# EasyEDA Pro project ProPrj_WriteBotDriver_2025-05-26.epro, board PCB
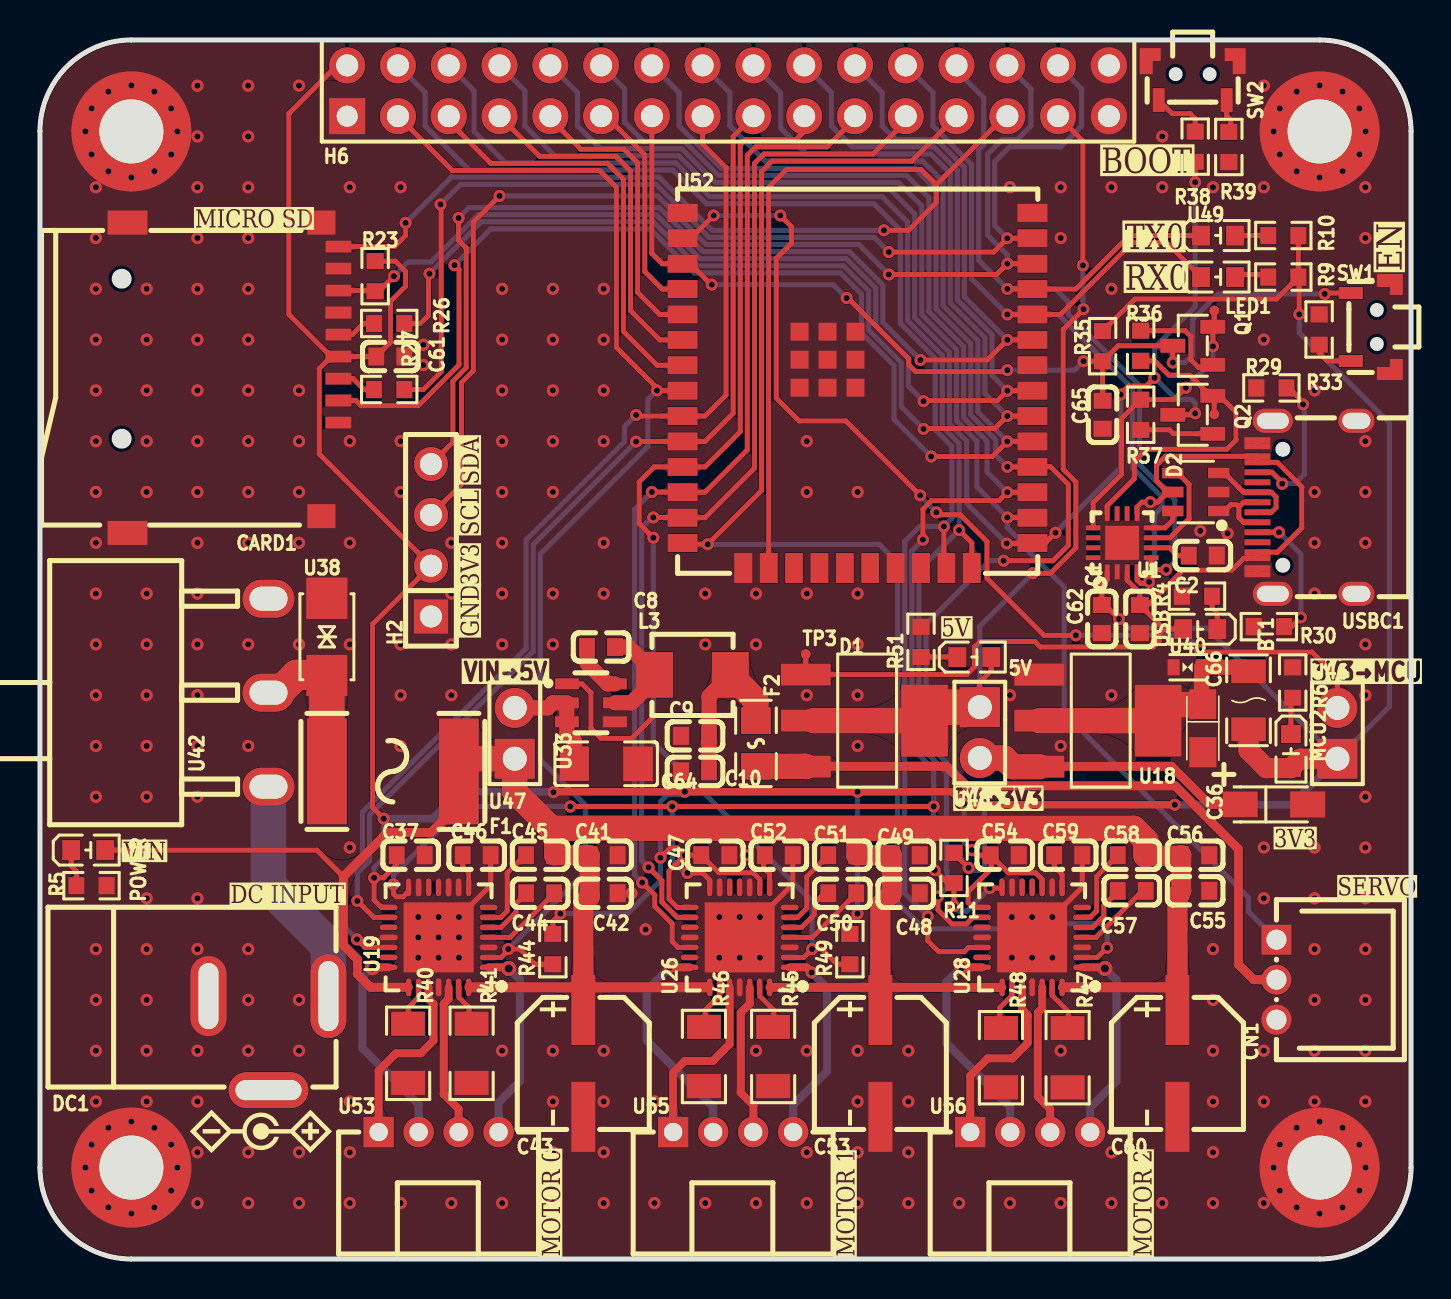
[diagram p5: board, top side]
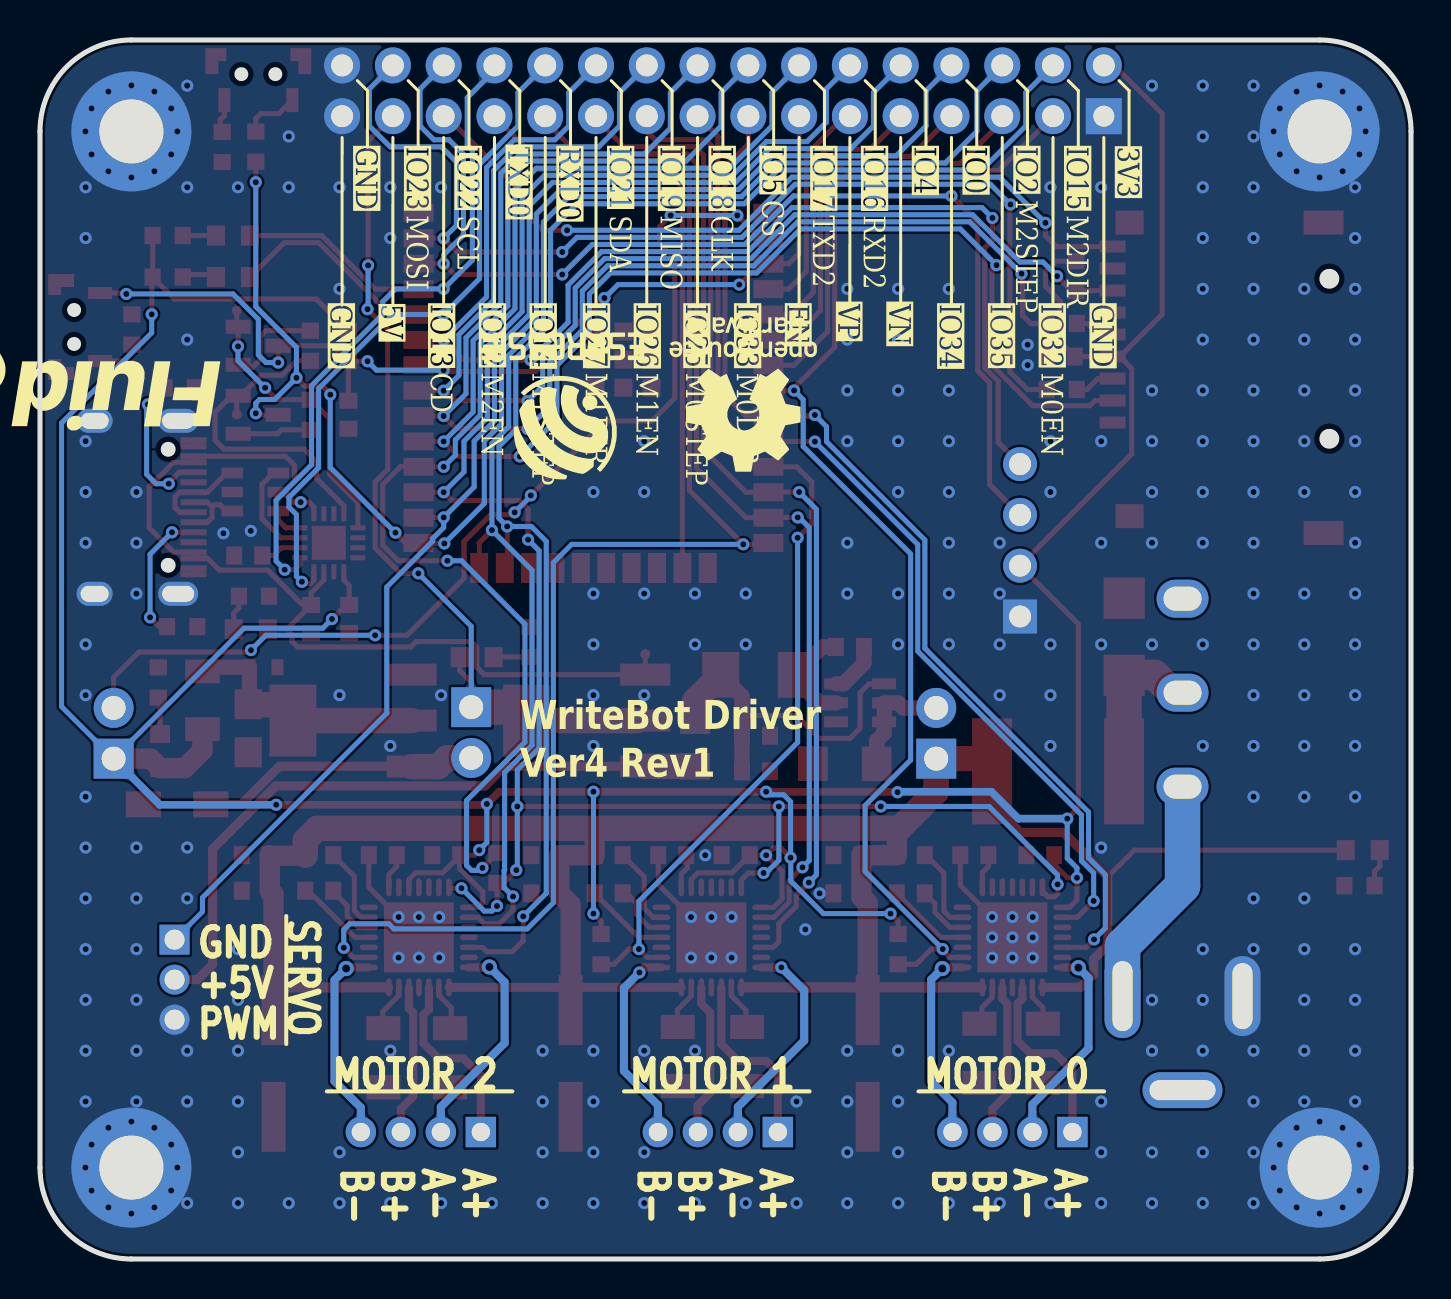
[diagram p6: board, bottom side, seen from below]

Outline 68.58 x 60.96 mm; copper layers: Top Layer, Bottom Layer. Coordinates in mm from the lower left corner of the outline.
Outline path: 0,56.39 0,4.57 arc(1.34,1.34) 4.57,0 64.01,0 arc(67.24,1.34) 68.58,4.57 68.58,56.39 arc(67.24,59.62) 64.01,60.96 4.57,60.96 arc(1.34,59.62) 0,56.39
Stack: Top Layer 0.035mm / Dielectric1 1.51mm FR4 er 4.5 / Bottom Layer 0.035mm

## Design rules (mm)
template: 自定义配置
spacing copperThickness1oz (default): track to track 0.102, other pairs 0.152 to 0.3
spacing copperThickness2oz: track to track 0.203, other pairs 0.152 to 0.3
track width copperThickness1oz (default): min 0.127, default 0.254, max 2.54
track width copperThickness2oz: min 0.254, default 0.457, max 2.54
track width MotorOutput: min 0.254, default 0.406, max 2.54
differential pair differentialPair (default): width min 0.127, default 0.254, max 2.54; gap min 0.152, default 0.152
via viaSize (default): diameter min 0.5, default 0.61, max 10; hole min 0.3, default 0.305, max 6.299
net VIN uses copperThickness2oz
net 5VBUCK uses copperThickness2oz
net M1OA+ uses MotorOutput
net M0OB+ uses MotorOutput
net M0OA+ uses MotorOutput
net M0OA- uses MotorOutput
net M0OB- uses MotorOutput
net M1OB+ uses MotorOutput
net M1OA- uses MotorOutput
net M1OB- uses MotorOutput
net M2OB+ uses MotorOutput
net M2OA+ uses MotorOutput
net M2OA- uses MotorOutput
net M2OB- uses MotorOutput
net 5V uses copperThickness2oz

## Placement (name value [footprint] x y rotation side)
5V  YLED0603R  [LED0603-FD]  46.74 30.1 180 top
BT1  nSMD100-24V  [F1206]  60.45 27.94 270 top
C1  1uF  [C0603]  55.02 32.01 270 top
C2  100nF  [C0603]  58.17 35.18 180 top
C8  100nF  [C0603]  28.07 30.61 0 top
C9  22uF  [C0603]  32.77 26.16 0 top
C10  22uF  [C0603]  32.77 24.38 0 top
C36  10uF  [CAP-SMD_L3.2-W1.6-RD-C7171]  61.72 22.73 0 top
C37  100nF  [C0603]  18.54 20.19 180 top
C41  100nF  [C0603]  28.19 20.19 180 top
C42  100nF  [C0603]  28.19 18.29 180 top
C43  100uF  [CAP-SMD_BD6.3-L6.5-W6.5-LS7.2-FD]  27.18 9.78 270 top
C44  22nF  [C0603]  25.02 18.29 0 top
C45  100nF  [C0603]  25.02 20.19 180 top
C46  2.2uF  [C0603]  21.84 20.19 180 top
C47  100nF  [C0603]  33.78 20.19 180 top
C48  100nF  [C0603]  43.31 18.29 180 top
C49  100nF  [C0603]  43.31 20.19 180 top
C50  22nF  [C0603]  40.13 18.29 0 top
C51  100nF  [C0603]  40.13 20.19 180 top
C52  2.2uF  [C0603]  36.96 20.19 180 top
C53  100uF  [CAP-SMD_BD6.3-L6.5-W6.5-LS7.2-FD]  42.04 9.78 270 top
C54  100nF  [C0603]  48.26 20.19 180 top
C55  100nF  [C0603]  57.78 18.42 180 top
C56  100nF  [C0603]  57.78 20.19 180 top
C57  22nF  [C0603]  54.61 18.42 0 top
C58  100nF  [C0603]  54.61 20.19 180 top
C59  2.2uF  [C0603]  51.44 20.19 180 top
C60  100uF  [CAP-SMD_BD6.3-L6.5-W6.5-LS7.2-FD]  56.9 9.78 270 top
C61  100nF  [C0603]  17.52 45.13 180 top
C62  100nF  [C0603]  53.11 32.01 270 top
C64  10uF  [C1206]  28.32 24.77 180 top
C65  680nF  [C0603]  53.15 42.22 270 top
C66  22uF  [CASE-A_3216]  58.17 26.54 270 top
CARD1  TF-01A  [TF-SMD_TF-01A]  9.65 44.07 270 top
CN1  PH-3AW  [CONN-TH_3P-P2.00_HCTL_PH-3AW_C2908635]  61.85 13.97 90 top
D1  20CJQ100  [SOT-223-3_L6.5-W3.4-P2.30-LS7.0-BR]  41.28 26.92 180 top
D2  USBLC6-2SC6  [SOT-23-6_L2.9-W1.6-P0.95-LS2.8-BL]  57.81 38.36 90 top
DC1  DC-005-5A-2.5  [DC-IN-TH_DC-005-5A-2.5]  11.43 10.8 0 top
F1  2920L400/30GR  [F2920]  17.65 24.38 180 top
F2  SL0805200  [F0805]  35.81 25.78 270 top
H2  PM2.54-1*4  [HDR-TH_4P-P2.54-V-F]  19.56 35.94 90 top
H6  B-2100S32P-B110  [HDR-TH_32P-P2.54-V-M-R2-C16-S2.54]  34.42 58.42 0 top
L3  4.7uH  [IND-SMD_L4.5-W4.1_IHLP]  32.64 29.21 0 top
LED1  YLED0603B  [LED0603-FD]  58.93 49.11 180 top
MCU2  YLED0603R  [LED0603-FD]  62.57 25.4 90 top
NOREF  -  [Pad_e30]  4.57 56.39 0 top
NOREF#2  -  [Pad_e123]  64.01 56.39 0 top
NOREF#3  -  [Pad_e125]  4.57 4.57 0 top
NOREF#4  -  [Pad_e124]  64.01 4.57 0 top
POWER  YLED0603R  [LED0603-FD]  2.41 20.45 180 top
Q1  MMS8050-H-TP  [SOT-23-3_L2.9-W1.3-P1.90-LS2.4-BR]  57.66 45.67 0 top
Q2  MMS8050-H-TP  [SOT-23-3_L2.9-W1.3-P1.90-LS2.4-BR]  57.66 42.22 0 top
R4  1kΩ  [R0603]  57.88 33.15 180 top
R5  5.1kΩ  [R0603]  2.58 18.67 0 top
R6  680Ω  [R0603]  62.66 28.83 90 top
R9  680Ω  [R0603]  62.19 49.11 0 top
R10  680Ω  [R0603]  62.19 51.18 0 top
R11  1kΩ  [R0603]  45.72 19.56 90 top
R23  10kΩ  [R0603]  16.76 49.15 90 top
R26  10Ω  [R0603]  17.47 46.78 0 top
R27  10Ω  [R0603]  17.47 43.48 0 top
R29  5.1kΩ  [R0603]  61.59 43.56 180 top
R30  5.1kΩ  [R0603]  61.47 31.62 180 top
R33  100Ω  [R0603]  63.98 46.48 270 top
R35  10kΩ  [R0603]  53.15 45.65 90 top
R36  10kΩ  [R0603]  55.06 45.67 270 top
R37  10kΩ  [R0603]  55.06 42.22 90 top
R38  10kΩ  [R0603]  57.78 55.63 270 top
R39  100Ω  [R0603]  59.47 55.61 90 top
R40  120mΩ  [R1206]  18.41 10.29 270 top
R41  120mΩ  [R1206]  21.59 10.29 270 top
R44  10kΩ  [R0603]  25.65 15.49 90 top
R45  120mΩ  [R1206]  36.67 10.13 270 top
R46  120mΩ  [R1206]  33.21 10.13 270 top
R47  120mΩ  [R1206]  51.4 10.07 270 top
R48  120mΩ  [R1206]  48.07 10.07 270 top
R49  10kΩ  [R0603]  40.51 15.49 90 top
R51  1kΩ  [R0603]  44.07 30.86 90 top
SW1  TS24CA  [SW-SMD_TS24CA]  66.55 46.61 270 top
SW2  TS24CA  [SW-SMD_TS24CA]  57.66 58.93 0 top
TP1  -  [Test-Point-0.5mm]  58.74 42.24 0 top
TP2  -  [Test-Point-0.5mm]  58.74 47.43 0 top
TP3  -  [Test-Point-0.5mm]  38.31 30.25 0 top
U1  CH343P  [TQFN-16_L3.0-W3.0-P0.50-BL-EP1.7]  54.13 35.82 0 top
U18  AMS1117-3.3  [SOT-223-3_L6.5-W3.4-P2.30-LS7.0-BR]  52.96 26.92 180 top
U19  TMC2209-LA-T  [QFN-28_L5.0-W5.0-P0.50-BL-EP]  19.94 16.08 90 top
U26  TMC2209-LA-T  [QFN-28_L5.0-W5.0-P0.50-BL-EP]  35 16.08 90 top
U28  TMC2209-LA-T  [QFN-28_L5.0-W5.0-P0.50-BL-EP]  49.63 16.08 90 top
U33  AP63205WU-7  [TSOT-23-6_L2.9-W1.6-P0.95-LS2.8-BL]  27.56 27.81 270 top
U38  SMAJ28CA  [DO-214AC_L4.3-W2.7-LS5.0-BI]  14.35 31.12 270 top
U40  H3V3LD5B  [SOD-523F_L1.7-W0.9-LS1.7-BI]  57.4 29.59 0 top
U42  SS-12M12G5  [SW-TH_SS-12M12G5]  11.43 28.32 90 top
U46  2.54-1*2  [HDR-TH_2P-P2.54-V-M]  64.9 26.29 90 top
U47  2.54-1*2  [HDR-TH_2P-P2.54-V-M]  23.75 26.29 90 top
U48  2.54-1*2  [HDR-TH_2P-P2.54-V-M]  47.01 26.33 270 top
U49  YLED0603G  [LED0603-FD]  58.93 51.18 180 top
U52  ESP32-WROOM-32UE-N16  [COMM-SMD_ESP32-WROOM-32UE-N16]  40.89 43.43 0 top
U53  WAFER-PH2.0-4PWZ  [CONN-TH_4P-P2.00_BX-PH2.0-4PWZ]  19.94 6.35 0 top
U55  WAFER-PH2.0-4PWZ  [CONN-TH_4P-P2.00_BX-PH2.0-4PWZ]  34.67 6.35 0 top
U56  WAFER-PH2.0-4PWZ  [CONN-TH_4P-P2.00_BX-PH2.0-4PWZ]  49.53 6.35 0 top
USB  YLED0603R  [LED0603-FD]  58.04 31.5 0 top
USBC1  TYPE-C-31-M-12  [USB-C_SMD-TYPE-C-31-M-12]  63.37 37.59 90 top

## Footprints (pads in the part's own frame, mm; a bottom-side part is the same pattern mirrored in y, then rotated)
C0603
  rect 0.8x0.9 smd: 1(-0.7,0) 2(0.7,0)
C1206
  rect 1.485x1.728 smd: 1(-1.593,0) 2(1.593,0)
CAP-SMD_BD6.3-L6.5-W6.5-LS7.2-FD
  rect 3.5x1.2 smd: 1(-2.67,0) 2(2.67,0)
CAP-SMD_L3.2-W1.6-RD-C7171
  rect 1.758x1.296 smd: 1(-1.687,0) 2(1.687,0)
CASE-A_3216
  rect 1.5x1.359 smd: 1(-1.2,0) 2(1.2,0)
COMM-SMD_ESP32-WROOM-32UE-N16
  rect 1.5x0.9 smd: 1(-8.75,8.88) 2(-8.75,7.61) 3(-8.75,6.34) 4(-8.75,5.07) 5(-8.75,3.8) 6(-8.75,2.53) 7(-8.75,1.26) 8(-8.75,-0.01) 9(-8.75,-1.28) 10(-8.75,-2.55) 11(-8.75,-3.82) 12(-8.75,-5.09) 13(-8.75,-6.36) 14(-8.75,-7.63) 25(8.75,-7.63) 26(8.75,-6.36) 27(8.75,-5.09) 28(8.75,-3.82) 29(8.75,-2.55) 30(8.75,-1.28) 31(8.75,-0.01) 32(8.75,1.26) 33(8.75,2.53) 34(8.75,3.8) 35(8.75,5.07) 36(8.75,6.34) 37(8.75,7.61) 38(8.75,8.88)
  rect 0.9x1.5 smd: 15(-5.715,-8.88) 16(-4.445,-8.88) 17(-3.175,-8.88) 18(-1.905,-8.88) 19(-0.635,-8.88) 20(0.635,-8.88) 21(1.905,-8.88) 22(3.175,-8.88) 23(4.445,-8.88) 24(5.715,-8.88)
  rect 0.9x0.9 smd: 39(-2.9,2.939) 39(-2.9,1.54) 39(-2.9,0.14) 39(-1.5,2.939) 39(-1.5,1.54) 39(-1.5,0.14) 39(-0.1,2.939) 39(-0.1,1.54) 39(-0.1,0.14)
CONN-TH_3P-P2.00_HCTL_PH-3AW_C2908635
  rect 1.5x1.5 hole 1: 1(2.001,0)
  round 1.5 hole 1: 2(0,0) 3(-2.001,0)
CONN-TH_4P-P2.00_BX-PH2.0-4PWZ
  rect 1.524x1.524 hole 0.914: 1(-3,0)
  round 1.524 hole 0.914: 2(-1,0) 3(1,0) 4(3,0)
DC-IN-TH_DC-005-5A-2.5
  oval 1.8x4.2 hole 1x3.5: 1(3,2.352)
  oval 1.8x4 hole 1x3.3: 2(-3,2.352)
  oval 4x1.8 hole 3.3x1: 3(-0.001,-2.352)
DO-214AC_L4.3-W2.7-LS5.0-BI
  rect 2.07x2.06 smd: 1(-1.929,0) 2(1.929,0)
F0805
  rect 1.335x1.5 smd: 1(-1.143,0) 2(1.143,0)
F1206
  rect 1.19x1.728 smd: 1(-1.445,0) 2(1.445,0)
F2920
  rect 2x5.3 smd: 1(-3.3,0) 2(3.3,0)
HDR-TH_2P-P2.54-V-M
  rect 2x2 hole 1.2: 1(-1.27,0)
  round 2 hole 1.2: 2(1.27,0)
HDR-TH_4P-P2.54-V-F
  rect 1.7x1.7 hole 1.1: 1(-3.81,0)
  round 1.7 hole 1.1: 2(-1.27,0) 3(1.27,0) 4(3.81,0)
HDR-TH_32P-P2.54-V-M-R2-C16-S2.54
  rect 1.8x1.8 hole 1.05: 1(-19.05,-1.27)
  round 1.8 hole 1.1x1.05: 2(-19.05,1.27) 3(-16.51,-1.27) 4(-16.51,1.27) 5(-13.97,-1.27) 6(-13.97,1.27) 7(-11.43,-1.27) 8(-11.43,1.27) 9(-8.89,-1.27) 10(-8.89,1.27) 11(-6.35,-1.27) 12(-6.35,1.27) 13(-3.81,-1.27) 14(-3.81,1.27) 15(-1.27,-1.27) 16(-1.27,1.27) 17(1.27,-1.27) 18(1.27,1.27) 19(3.81,-1.27) 20(3.81,1.27) 21(6.35,-1.27) 22(6.35,1.27) 23(8.89,-1.27) 24(8.89,1.27) 25(11.43,-1.27) 26(11.43,1.27) 27(13.97,-1.27) 28(13.97,1.27) 29(16.51,-1.27) 30(16.51,1.27) 31(19.05,-1.27) 32(19.05,1.27)
IND-SMD_L4.5-W4.1_IHLP
  rect 1.855x2.286 smd: 1(-1.893,0) 2(1.893,0)
LED0603-FD
  rect 0.9x1 smd: 1(-0.85,0) 2(0.85,0)
Pad_e30
  round 6 hole 3.2: 1(0,0)
Pad_e123
  round 6 hole 3.2: 1(0,0)
Pad_e124
  round 6 hole 3.2: 1(0,0)
Pad_e125
  round 6 hole 3.2: 1(0,0)
QFN-28_L5.0-W5.0-P0.50-BL-EP
  oval 0.28x0.9 smd: 1(-1.502,-2.5) 2(-1.001,-2.5) 3(-0.5,-2.5) 4(0,-2.5) 5(0.5,-2.5) 6(1,-2.5) 7(1.501,-2.5) 15(1.501,2.5) 16(1,2.5) 17(0.5,2.5) 18(0,2.5) 19(-0.5,2.5) 20(-1.001,2.5) 21(-1.502,2.5)
  oval 0.9x0.28 smd: 8(2.5,-1.502) 9(2.5,-1.001) 10(2.5,-0.5) 11(2.5,0) 12(2.5,0.5) 13(2.5,1) 14(2.5,1.501) 22(-2.5,1.501) 23(-2.5,1) 24(-2.5,0.5) 25(-2.5,0) 26(-2.5,-0.5) 27(-2.5,-1.001) 28(-2.5,-1.502)
  rect 3.5x3.5 smd: 29(0,0)
R0603
  rect 0.806x0.864 smd: 1(-0.753,0) 2(0.753,0)
R1206
  rect 1.208x1.701 smd: 1(-1.479,0) 2(1.479,0)
SOD-523F_L1.7-W0.9-LS1.7-BI
  rect 0.6x0.8 smd: 1(-0.7,0) 2(0.7,0)
SOT-23-3_L2.9-W1.3-P1.90-LS2.4-BR
  rect 1.25x0.7 smd: 1(1,-0.95) 2(1,0.95) 3(-1,0)
SOT-23-6_L2.9-W1.6-P0.95-LS2.8-BL
  rect 0.532x1.072 smd: 1(-0.95,-1.149) 2(0,-1.149) 3(0.95,-1.149) 4(0.95,1.149) 5(0,1.149) 6(-0.95,1.149)
SOT-223-3_L6.5-W3.4-P2.30-LS7.0-BR
  rect 2.5x1.1 smd: 1(2.97,-2.3) 2(2.97,0) 3(2.97,2.3)
  rect 2.34x3.6 smd: 4(-2.97,0)
SW-SMD_TS24CA
  custom 1.05x1.3 smd: 1(-2.125,0.975) 2(2.125,0.975)
  rect 0.6x1.2 smd: 3(-1.7,-0.975) 4(1.7,-0.975)
SW-TH_SS-12M12G5
  oval 1.9x2.6 hole 1.2x1.9: 1(-4.7,0) 2(0,0) 3(4.7,0)
Test-Point-0.5mm
  round 0.5 smd: 1(0,0)
TF-SMD_TF-01A
  rect 0.6x1.3 smd: 1(2.24,5.276) 2(1.14,5.276) 3(0.04,5.276) 4(-1.06,5.276) 5(-2.16,5.276) 6(-3.26,5.276) 7(-4.36,5.276) 8(-5.46,5.276) 9(-6.56,5.276)
  rect 1.2x1.4 smd: 10(-7.76,4.426) 13(6.92,4.426)
  rect 1.2x2 smd: 11(-7.76,-5.276) 12(7.76,-5.276)
TQFN-16_L3.0-W3.0-P0.50-BL-EP1.7
  rect 0.25x0.75 smd: 1(-0.749,-1.45) 2(-0.248,-1.45) 3(0.252,-1.45) 4(0.751,-1.45) 9(0.75,1.45) 10(0.25,1.45) 11(-0.25,1.45) 12(-0.749,1.45)
  rect 0.75x0.25 smd: 5(1.45,-0.75) 6(1.45,-0.25) 7(1.45,0.25) 8(1.45,0.75) 13(-1.45,0.75) 14(-1.45,0.25) 15(-1.45,-0.25) 16(-1.45,-0.75)
  rect 1.7x1.7 smd: 17(0.001,0)
TSOT-23-6_L2.9-W1.6-P0.95-LS2.8-BL
  rect 0.55x1.2 smd: 1(-0.95,-1.2) 2(0,-1.2) 3(0.95,-1.2) 4(0.95,1.2) 5(0,1.2) 6(-0.95,1.2)
USB-C_SMD-TYPE-C-31-M-12
  oval 1.2x2 hole 0.8x1.6: 0(-4.325,1.706) 1(4.325,1.706)
  oval 1.2x1.8 hole 0.8x1.4: 2(4.325,-2.474) 3(-4.325,-2.474)
  rect 0.3x1.3 smd: A1(-3.35,2.474) A4(-2.55,2.474) A5(-1.25,2.474) A6(-0.25,2.474) A7(0.25,2.474) A8(1.25,2.474) A9(2.55,2.474) A12(3.35,2.474) B1(3.05,2.474) B4(2.25,2.474) B5(1.75,2.474) B6(0.75,2.474) B7(-0.75,2.474) B8(-1.75,2.474) B9(-2.25,2.474) B12(-3.05,2.474)

## Nets
As in the schematic, except:
GND: C1.2 C2.1 C9.1 C10.1 C36.2 C37.1 C41.1 C42.1 C43.2 C46.1 C47.1 C48.1 C49.1 C52.1 C53.2 C54.1 C55.1 C56.1 C59.1 C60.2 C61.1 C62.2 C64.1 C65.2 C66.2 CARD1.6 CARD1.10 CARD1.11 CARD1.12 CARD1.13 CN1.3 D2.2 DC1.2 H2.1 H6.1 H6.31 H6.32 NOREF.1 NOREF#2.1 NOREF#3.1 NOREF#4.1 R4.2 R5.2 R6.2 R29.2 R30.2 R33.1 R39.1 R40.2 R41.2 R45.2 R46.2 R47.2 R48.2 R51.2 SW1.1 SW1.2 SW2.1 SW2.2 U1.2 U1.17 U18.1 U19.3 U19.9 U19.10 U19.13 U19.18 U19.25 U19.29 U26.3 U26.10 U26.13 U26.18 U26.25 U26.29 U28.3 U28.9 U28.13 U28.18 U28.25 U28.29 U33.4 U38.1 U40.1 U52.1 U52.15 U52.38 U52.39 USBC1.0 USBC1.1 USBC1.2 USBC1.3 USBC1.A1 USBC1.A12 USBC1.B1 USBC1.B12

Pads without a net: CARD1 1 8; DC1 3; U1 10 11 14 15 16; U19 7 11 12 17 20; U26 7 11 12 17 20; U28 7 11 12 17 20; U42 3; U52 17 18 19 20 21 22 32; USBC1 A8 B8

## Via types
v1: diameter 0.61, hole 0.305, Top Layer to Bottom Layer, 392 vias
v2: diameter 0.762, hole 0.406, Top Layer to Bottom Layer, 4 vias

## Routing (per net, layer and track width the routed paths; a pad name or vN(x,y) marks a point on that pad's centre or on a via; arc(x,y) is an arc through that point)
3V3: length 212.6
  Top Layer w0.254: C54.2 46.86,20.19 v1(46.61,20.45) ; R23.2 17.78,49.9 18.29,49.39 18.29,48.64 17.53,47.88 17.53,45.83 C61.2 16.82,45.13 CARD1.4 ; CARD1.4 14.88,45.09 14.52,45.09 13.97,44.53 13.97,40.26 H2.2 16.64,31.75 16.64,22.58 v1(17.19,22.02) ; CARD1.4 14.56,45.13 12.45,47.24 12.45,57.28 14.86,59.69 H6.2 ; U1.1 53.38,33.95 53.11,33.68 C62.1 53.27,32.71 v1(53.97,32) ; v1(40.89,17.27) 40.51,16.89 R49.2 ; C37.2 17.84,19.72 17.18,19.06 v1(16.71,19.06) 16.71,17.95 17.08,17.59 U19.15 ; U28.10 50.13,18.99 49.8,19.31 48.44,19.31 47.6,20.16 47.59,20.16 47.59,19.52 46.43,18.36 46.43,17.83 46.68,17.59 U28.15 ; v1(32.26,20.19) 31.89,20.56 31.53,20.56 v1(31.04,20.07) ; v1(32.26,20.19) 31.46,19.4 31.46,18 31.88,17.59 U26.15 ; v1(32.26,20.19) C47.2 33.96,19.31 35.67,19.31 36,18.99 U26.9 ; v1(62.99,47.24) 62.98,47.25 62.98,48.82 62.87,48.94 ; R35.2 54.76,48.01 61.85,48.01 62.95,49.1 62.95,51.18 ; v1(26.03,17.27) 25.65,16.89 R44.2
  Top Layer w0.381: v1(25.69,23.34) 25.71,23.37 v1(32.26,23.37) v1(40.89,23.37) 45.62,23.37 v1(46.23,22.76) 46.27,22.71 v1(56.76,22.71)
  Top Layer w1.016: BT1.2 60.45,25.44 61.34,24.55 MCU2.1 63.04,25.02 U46.1
  Bottom Layer w0.254: v1(17.19,22.02) 17.19,20.04 16.71,19.56 v1(16.71,19.06) ; v1(46.23,22.76) 46.23,20.83 v1(46.61,20.45) ; 56.75,22.73 v1(56.76,22.71) ; v1(40.89,17.27) v1(40.89,23.37) ; v1(26.03,17.27) 29.39,17.27 31.02,18.9 31.02,20.06 v1(31.04,20.07) 31.04,22.87 31.38,23.22 32.11,23.22 v1(32.26,23.37) ; v1(53.97,32) 54.43,31.55 58.37,31.55 U46.1 67.5,27.62 67.5,41.81 62.99,46.32 v1(62.99,47.24)
  Bottom Layer w0.381: v1(17.19,22.02) 19.64,22.02 20.99,23.37 25.66,23.37 v1(25.69,23.34) ; v1(56.76,22.71) 62.59,22.71 U46.1
5V: length 44.6
  Top Layer w0.254: U48.1 46.99,27.62 46.99,28.83 47.59,29.43 5V.1 ; v1(52.2,47.5) 51.18,46.48 51.18,39.49 51.82,38.86 51.82,35.57 50.54,34.29 v1(49.66,34.29) ; v1(52.17,49.69) 52.17,55.91 H6.29
  Top Layer w1.27: 38.69,26.92 D1.4 44.92,27.6
  Top Layer w1.778: U48.1 44.92,27.6
  Bottom Layer w0.254: v1(49.66,34.29) 47.01,31.64 U48.1 ; v1(52.17,49.69) 52.17,47.53 v1(52.2,47.5)
5VBUCK: length 33.9
  Top Layer w0.457: 38.29,24.64 45.34,24.64 46.32,23.66 56.79,23.66 59.94,20.51 59.94,14.73 60.71,13.97 CN1.2
  Top Layer w1.27: F2.2 38.29,24.64 ; D1.3 38.29,24.64
GND: length 14.7
  Top Layer w0.254: v1(50.64,17.1) 52.13,18.59 C59.1 ; C52.1 37.66,18.74 v1(36.01,17.1) U26.29 ; C46.1 22.54,18.69 v1(20.96,17.1) v1(19.94,16.08) ; USBC1.A12 USBC1.B1 ; USBC1.B12 USBC1.A1
  vias: v1(2.27,56.39) v1(2.27,4.57) v1(2.58,57.54) v1(2.58,55.24) v1(2.58,5.72) v1(2.58,3.42) v1(2.8,53.6) v1(2.8,51.06) v1(2.8,48.52) v1(2.8,45.98) v1(2.8,43.44) v1(2.8,40.9) v1(2.8,38.36) v1(2.8,35.82) v1(2.8,33.28) v1(2.8,30.74) v1(2.8,28.2) v1(2.8,25.66) v1(2.8,23.12) v1(2.8,15.5) v1(2.8,12.96) v1(2.8,10.42) v1(2.8,7.88) v1(3.42,58.38) v1(3.42,54.4) v1(3.42,6.56) v1(3.42,2.58) v1(4.57,58.69) v1(4.57,54.09) v1(4.57,6.87) v1(4.57,2.27) v1(5.34,48.52) v1(5.34,45.98) v1(5.34,43.44) v1(5.34,40.9) v1(5.34,38.36) v1(5.34,33.28) v1(5.34,30.74) v1(5.34,28.2) v1(5.34,25.66) v1(5.34,23.12) v1(5.34,18.04) v1(5.34,15.5) v1(5.34,12.96) v1(5.34,10.42) v1(5.34,7.88) v1(5.72,58.38) v1(5.72,54.4) v1(5.72,6.56) v1(5.72,2.58) v1(6.56,57.54) v1(6.56,55.24) v1(6.56,5.72) v1(6.56,3.42) v1(6.87,56.39) v1(6.87,4.57) v1(7.88,58.68) v1(7.88,56.14) v1(7.88,53.6) v1(7.88,51.06) v1(7.88,48.52) v1(7.88,45.98) v1(7.88,43.44) v1(7.88,40.9) v1(7.88,38.36) v1(7.88,35.82) v1(7.88,33.28) v1(7.88,30.74) v1(7.88,28.2) v1(7.88,25.66) v1(7.88,23.12) v1(7.88,18.04) v1(7.88,15.5) v1(7.88,10.42) v1(7.88,7.88) v1(7.88,5.34) v1(7.88,2.8) v1(10.42,58.68) v1(10.42,56.14) v1(10.42,53.6) v1(10.42,51.06) v1(10.42,48.52) v1(10.42,45.98) v1(10.42,43.44) v1(10.42,40.9) v1(10.42,38.36) v1(10.42,35.82) v1(10.42,30.74) v1(10.42,25.66) v1(10.42,15.5) v1(10.42,12.96) v1(10.42,10.42) v1(10.42,5.34) v1(10.42,2.8) v1(12.96,58.68) v1(12.96,43.44) v1(12.96,40.9) v1(12.96,38.36) v1(12.96,35.82) v1(12.96,30.74) v1(12.96,12.96) v1(12.96,10.42) v1(12.96,5.34) v1(12.96,2.8) v1(15.5,53.6) v1(15.5,40.9) v1(15.5,35.82) v1(15.5,30.74) v1(15.5,20.58) v1(15.5,7.88) v1(15.5,5.34) v1(15.5,2.8) v1(18.04,53.6) v1(18.04,40.9) v1(18.04,38.36) v1(18.04,30.74) v1(18.04,28.2) v1(18.04,25.66) v1(18.04,2.8) v1(18.92,17.1) v1(18.92,16.08) v1(18.92,15.07) v1(19.18,45.72) v1(19.18,44.7) v1(19.94,17.1) v1(19.94,15.07) v1(20.58,35.82) v1(20.58,33.28) v1(20.58,30.74) v1(20.58,28.2) v1(20.58,2.8) v1(20.96,16.08) v1(20.96,15.07) v1(23.12,48.52) v1(23.12,45.98) v1(23.12,43.44) v1(23.12,40.9) v1(23.12,38.36) v1(23.12,35.82) v1(23.12,33.28) v1(23.12,30.74) v1(23.12,10.42) v1(23.12,2.8) v1(25.66,48.52) v1(25.66,45.98) v1(25.66,43.44) v1(25.66,40.9) v1(25.66,38.36) v1(25.66,33.28) v1(25.66,30.74) v1(25.66,10.42) v1(25.66,7.88) v1(25.66,5.34) v1(25.66,2.8) v1(28.2,48.52) v1(28.2,45.98) v1(28.2,43.44) v1(28.2,40.9) v1(28.2,35.82) v1(28.2,33.28) v1(28.2,10.42) v1(28.2,7.88) v1(28.2,5.34) v1(28.2,2.8) v1(29.58,18.29) v1(30.29,16.48) v1(30.74,7.88) v1(30.74,2.8) v1(33.28,33.28) v1(33.28,30.74) v1(33.28,2.8) v1(33.98,17.1) v1(33.98,15.07) v1(35,17.1) v1(35,15.07) v1(35.31,20.19) v1(35.82,33.28) v1(35.82,30.74) v1(35.82,10.42) v1(35.82,2.8) v1(36.01,15.07) v1(38.36,40.9) v1(38.36,38.36) v1(38.36,33.28) v1(38.36,28.2) v1(38.36,10.42) v1(38.36,5.34) v1(38.36,2.8) v1(40.9,38.36) v1(40.9,33.28) v1(40.9,30.74) v1(40.9,28.2) v1(40.9,25.66) v1(40.9,10.42) v1(40.9,7.88) v1(40.9,5.34) v1(40.9,2.8) v1(43.44,10.42) v1(43.44,7.88) v1(43.44,5.34) v1(43.44,2.8) v1(45.98,2.8) v1(48.52,53.6) v1(48.52,28.2) v1(48.52,2.8) v1(48.61,17.1) v1(48.61,15.07) v1(49.63,17.1) v1(49.63,15.07) v1(50.64,15.07) v1(51.06,53.6) v1(51.06,51.06) v1(51.06,25.66) v1(51.06,10.42) v1(51.06,2.8) v1(53.6,53.6) v1(53.6,48.52) v1(53.6,28.2) v1(53.6,5.34) v1(53.6,2.8) v1(56.14,56.14) v1(56.14,53.6) v1(56.14,2.8) v1(58.04,36.41) v1(58.68,53.6) v1(58.68,15.5) v1(58.68,12.96) v1(58.68,10.42) v1(58.68,7.88) v1(58.68,5.34) v1(58.68,2.8) v1(59.41,36.29) v1(61.22,58.68) v1(61.22,53.6) v1(61.22,45.98) v1(61.22,20.58) v1(61.22,18.04) v1(61.22,10.42) v1(61.22,7.88) v1(61.22,2.8) v1(61.71,56.39) v1(61.71,4.57) v1(62.02,57.54) v1(62.02,55.24) v1(62.02,5.72) v1(62.02,3.42) v1(62.86,58.38) v1(62.86,54.4) v1(62.86,6.56) v1(62.86,2.58) v1(63.76,43.44) v1(63.76,38.36) v1(63.76,35.82) v1(63.76,33.28) v1(63.76,20.58) v1(63.76,18.04) v1(63.76,15.5) v1(63.76,12.96) v1(63.76,10.42) v1(63.76,7.88) v1(64.01,58.69) v1(64.01,54.09) v1(64.01,6.87) v1(64.01,2.27) v1(65.16,58.38) v1(65.16,54.4) v1(65.16,6.56) v1(65.16,2.58) v1(66,57.54) v1(66,55.24) v1(66,5.72) v1(66,3.42) v1(66.31,56.39) v1(66.3,53.6) v1(66.3,51.06) v1(66.3,40.9) v1(66.3,38.36) v1(66.3,35.82) v1(66.3,30.74) v1(66.3,28.2) v1(66.3,23.12) v1(66.3,20.58) v1(66.3,18.04) v1(66.3,15.5) v1(66.3,12.96) v1(66.3,10.42) v1(66.3,7.88) v1(66.31,4.57)
VBUS: length 49.7
  Top Layer w0.254: U1.3 54.38,33.95 55.02,33.31 C1.1 ; 56.42,38.36 55.91,37.85 v1(55.54,37.85) 55.12,37.85 54.88,37.61 54.88,37.27 ; 56.42,38.36 55.85,38.92 55.85,39.69 56.3,40.14 USBC1.A9 USBC1.B4 60.9,39.84 61.9,39.84 63.12,38.62 63.12,36.57 61.89,35.34 USBC1.B9 USBC1.A4 60.2,35.04 59.61,34.45 57.18,34.45 55.5,32.77 55.08,32.77 C1.1 ; 56.42,38.36 56.66,38.36 ; 56.23,31.5 55.97,31.24 55.97,30.88 55.7,30.61 50.04,30.61 49.77,30.88 47.02,30.88 46.74,30.59 46.74,29.6 46.36,29.22 D1.1 TP3.1 ; 56.23,31.5 55.72,32.01 C1.1 ; 56.23,31.5 USB.1
VIN: length 127
  Top Layer w0.254: 15.17,19.12 13.84,20.45 3.26,20.45
  Top Layer w0.457: 48.11,13.58 36.52,13.58 ; F1.1 20.95,22.73 19.56,21.34 17.39,21.34 15.17,19.12 15.17,15.7 15.88,14.99 15.88,14.25 16.54,13.59 18.41,13.59 18.42,13.58
  Top Layer w0.508: 33.45,13.58 21.49,13.58 ; 56.9,13.21 56.52,13.58 51.17,13.58
  Top Layer w1.016: 40.83,21.21 C51.1 C49.2 C48.2 42.04,17.72 42.04,13.58 ; 25.72,21.54 C45.1 C41.2 27.49,18.12 27.18,17.8 C43.1 ; 56.9,12.45 56.9,18.23 C55.2 C56.2 57.06,20.17 55.34,20.17
  Top Layer w1.27: C58.1 55.31,20.93 54.7,21.54 25.58,21.54 23.75,23.37 U47.1 21.59,25.02 F1.1
CC1: length 7
  Top Layer w0.254: 62.09,31.62 62.61,31.62 v1(63.07,32.09) ; USBC1.A5 v1(61.98,36.34)
  Bottom Layer w0.254: v1(63.07,32.09) 63.07,35.24 v1(61.98,36.34)
CC2: length 7.5
  Top Layer w0.254: v1(62.14,38.77) 62.14,38.83 61.62,39.34 USBC1.B5 ; v1(63.18,42.74) 63.18,42.85 62.48,43.56
  Bottom Layer w0.254: v1(63.18,42.74) 63.25,42.67 63.25,39.24 62.77,38.77 v1(62.14,38.77)
CD: length 67.4
  Top Layer w0.254: H6.27 48.26,57.15 44.83,53.72 ; CARD1.9 17.74,50.63 18.29,51.18 v1(18.29,51.82) ; 44.83,53.72 44.07,54.48 37.34,54.48 36.45,53.59 U52.16 ; 44.83,53.72 44.83,52.83 43.44,51.45 v1(42.22,51.45)
  Bottom Layer w0.254: v1(42.22,51.45) 33.61,51.45 30.96,54.1 20.57,54.1 v1(18.29,51.82)
CLK: length 2
  Top Layer w0.254: CARD1.5 15.62,46.23 16.18,46.78 R26.1
CMD: length 2
  Top Layer w0.254: R27.1 16.21,43.48 15.66,44.03 CARD1.3
CS: length 79.2
  Top Layer w0.254: CARD1.2 15.81,42.93 16.06,42.67 18.92,42.67 20.96,44.71 20.96,49.47 v1(20.73,49.7) ; v1(44.58,40.13) 47.63,40.13 v1(48.39,40.88) U52.29
  Bottom Layer w0.254: H6.16 34.51,58.33 34.51,56.66 36.27,54.9 44.16,54.9 45.18,53.88 45.18,47.67 46.91,45.93 46.91,42.36 v1(48.39,40.88) ; v1(44.58,40.13) 42.72,41.99 42.72,44.68 41.1,46.31 41.1,48.26 40.04,49.31 32.73,49.31 30.53,51.51 22.55,51.51 v1(20.73,49.7)
D+: length 5.1
  Top Layer w0.254: 55.58,36.07 56.52,36.07 57.48,37.02 57.48,38.74 56.91,39.31 56.66,39.31
D-: length 1.7
  Top Layer w0.254: 56.66,37.41 56.66,36.95 56.28,36.57 55.58,36.57
DAT0: length 65.2
  Top Layer w0.254: CARD1.7 16.7,48.43 16.74,48.4 R23.1 16.95,48.4 v1(17.7,49.15) ; U52.31 v1(48.39,43.42) 47.89,42.93 44.23,42.93 v1(44.2,42.9)
  Bottom Layer w0.254: H6.20 39.59,58.33 39.59,56.66 40.63,55.62 44.71,55.62 45.89,54.44 45.89,47.96 47.62,46.22 47.62,44.19 v1(48.39,43.42) ; v1(44.2,42.9) 43.43,43.66 43.43,45.06 41.81,46.69 41.81,48.55 40.34,50.02 33.02,50.02 30.83,52.22 21.93,52.22 19.56,49.86 18.41,49.86 v1(17.7,49.15)
DN: length 3.8
  Top Layer w0.254: USBC1.B7 60.2,36.84 59.97,37.08 59.97,37.61 ; 59.97,37.61 59.86,37.72 59.56,37.72 59.25,37.41 D2.1 ; 59.97,37.61 60.2,37.84 USBC1.A7
DP: length 4.9
  Top Layer w0.254: USBC1.A6 60.9,37.34 61.59,37.34 61.83,37.58 61.83,38.11 61.59,38.34 USBC1.B6 60.21,38.34 60.14,38.41 60.13,38.41 59.97,38.58 59.97,38.58 59.25,39.31 D2.3
DTR: length 16.9
  Top Layer w0.254: Q2.2 58.6,43.11 57.52,44.2 56.47,44.2 55.75,44.92 R36.2 ; Q2.2 58.74,43.09 TP1.1 ; Q2.2 59,43.17 59.82,42.35 59.82,40.95 59.37,40.5 55.36,40.5 54.74,39.88 54.74,39.02 53.38,37.67 U1.12
EN: length 50.3
  Top Layer w0.254: v1(40.35,48.06) 40.41,48.06 43.46,45.01 43.46,44.72 43.8,44.37 48.31,44.37 v1(48.39,44.45) ; v1(56.66,44.83) Q1.3 53.93,45.67 R35.1 ; SW1.3 64.31,48.31 v1(64.26,48.26) ; v1(33.6,48.73) 33.57,48.73 32.52,49.77 U52.3 31.12,49.77 30.61,50.29 H6.13 ; R35.1 C65.1 ; R35.1 v1(52.2,44.9)
  Bottom Layer w0.254: v1(40.35,48.06) 40.34,48.06 39.66,48.73 v1(33.6,48.73) ; v1(56.66,44.83) 57.28,44.83 57.66,45.21 57.66,47 58.92,48.26 v1(64.26,48.26) ; v1(48.39,44.45) 51.75,44.45 v1(52.2,44.9)
IO0: length 72.1
  Top Layer w0.254: v1(55.75,44.07) 55.34,43.66 54.45,43.66 54.06,43.26 v1(54.06,43.23) ; R38.2 v1(57.78,53.85) ; v1(57.78,42.29) 57.71,42.22 Q2.3 ; v1(50.8,36.32) 50.28,35.8 U52.25 49.62,35.78 v1(48.35,35.78)
  Bottom Layer w0.254: v1(57.78,53.85) 57.78,47.63 55.75,45.59 v1(55.75,44.07) 56.84,42.98 57.6,42.98 57.78,42.8 v1(57.78,42.29) ; v1(48.35,35.78) 46.35,37.78 46.35,40.9 45.49,41.77 45.49,45.34 43.75,47.08 43.75,52.26 42.53,53.48 33.64,53.48 31.95,55.17 25.75,55.17 24.26,56.66 24.26,58.42 H6.8 ; v1(54.06,43.23) 54.06,39.58 v1(50.8,36.32)
IO2: length 69.2
  Top Layer w0.254: v1(45.97,36.45) 46.61,35.81 U52.24 ; v1(44.92,18.13) 44.92,17.45 45.62,16.75 46.34,16.75 46.67,17.08 U28.16
  Bottom Layer w0.254: v1(44.92,18.13) 45.36,18.57 45.36,19.44 45.34,19.46 45.34,24.33 43.97,25.7 43.97,34.44 v1(45.97,36.45) 45.97,40.78 45.14,41.62 45.14,45.19 43.4,46.93 43.4,51.85 42.12,53.13 33.49,53.13 31.8,54.81 23.29,54.81 21.72,56.39 21.72,58.42 H6.6
IO4: length 67.8
  Top Layer w0.254: v1(48.39,37.08) 49.63,37.08 U52.26
  Bottom Layer w0.254: CN1.1 60.45,17.37 60.45,18.07 51.23,27.29 51.23,33.6 48.94,35.9 48.94,36.02 48.39,36.58 v1(48.39,37.08) 46.86,38.61 46.86,40.9 45.85,41.92 45.85,45.49 44.11,47.22 44.11,52.67 42.94,53.84 33.79,53.84 32.1,55.52 28.02,55.52 26.89,56.66 26.89,58.33 H6.10
IO12: length 72.4
  Top Layer w0.254: 52.13,15.08 52.89,15.08 53.37,15.56 v1(53.38,15.56) ; H6.25 43.6,54.9 36.62,54.9 36.09,54.38 36.09,38.43 v1(33.4,35.74) 32.21,35.74 U52.14
  Bottom Layer w0.254: v1(53.38,15.56) 53.38,16.47 53.09,16.76 51.13,16.76 50.88,16.51 44.21,16.51 42.9,17.82 42.9,34.82 41.98,35.74 v1(33.4,35.74)
IO14: length 51.7
  Top Layer w0.254: U26.16 31.87,17.08 31.11,17.85 31.11,18.92 v1(30.44,19.59) ; H6.23 43.31,56.9 41.67,55.26 36.21,55.26 35.74,54.79 35.74,39.55 33.26,37.07 U52.13 32.13,37.08 v1(30.68,37.08)
  Bottom Layer w0.254: v1(30.44,19.59) 30.1,19.93 30.1,36.58 30.61,37.08 v1(30.68,37.08)
IO15: length 73.5
  Top Layer w0.254: U52.23 45.21,34.68 v1(45.21,36.63) ; v1(44.41,17.13) 44.41,15.92 44.96,15.37 46.23,15.37 46.44,15.58 U28.19
  Bottom Layer w0.254: H6.4 19.27,58.33 19.27,56.66 21.47,54.46 31.66,54.46 33.34,52.77 41.72,52.77 43.04,51.45 43.04,46.78 44.78,45.04 44.78,41.47 45.62,40.64 45.62,37.04 v1(45.21,36.63) 44,36.63 43.26,35.89 43.26,18.29 v1(44.41,17.13)
IO16: length 102.3
  Top Layer w0.254: v1(17.68,18.73) 17.68,18.26 17.83,18.11 18.16,18.11 18.44,18.39 U19.14 ; v1(47.5,18.54) 48.08,18.54 U28.14 ; v1(44.16,35.97) 44.16,37.5 44.59,37.92 47.96,37.92 v1(48.39,38.34) U52.27 ; v1(44.75,19.45) 45.4,18.8 R11.1 v1(45.72,17.65) ; v1(32.38,19.3) 33.15,19.3 33.5,18.95 U26.14 ; v1(44.7,22.63) v1(31.62,22.63) v1(26.53,22.63)
  Bottom Layer w0.254: v1(47.5,18.54) 46.35,17.4 45.97,17.4 v1(45.72,17.65) ; v1(44.75,19.45) 44.7,19.5 v1(44.7,22.63) 44.7,24.46 43.61,25.55 43.61,35.42 v1(44.16,35.97) ; H6.12 29.25,58.51 29.25,56.84 30.21,55.88 32.25,55.88 33.93,54.19 43.34,54.19 44.46,53.07 44.46,47.37 46.2,45.63 46.2,42.06 47.37,40.89 47.37,39.36 v1(48.39,38.34) ; v1(17.68,18.73) 17.68,19.2 21.11,22.63 v1(26.53,22.63) ; v1(31.62,22.63) 31.62,19.94 32.26,19.3 v1(32.38,19.3)
IO17: length 63.6
  Top Layer w0.254: v1(48.2,34.92) 50.67,34.92 51.44,35.69 51.44,38.74 50.55,39.62 49.65,39.62 U52.28 v1(48.39,39.61) ; v1(46.45,19.56) 45.72,20.29 R11.2
  Bottom Layer w0.254: v1(48.2,34.92) 47.49,34.92 44.32,31.75 44.32,25.85 47.24,22.92 47.24,19.69 46.99,19.43 46.58,19.43 v1(46.45,19.56) ; v1(48.39,39.61) 47.8,40.2 47.8,40.97 46.56,42.21 46.56,45.78 44.82,47.52 44.82,53.48 43.75,54.55 34.08,54.55 31.97,56.66 31.97,58.33 H6.14
IO18: length 68.1
  Top Layer w0.254: v1(44.2,41.51) 44.21,41.53 47.76,41.53 v1(48.39,42.15) U52.30 ; v1(19.48,49.27) 19.43,49.22 19.43,47.19 19.02,46.78 R26.2
  Bottom Layer w0.254: v1(44.2,41.51) 43.08,42.63 43.08,44.83 41.45,46.45 41.45,48.41 40.19,49.67 32.88,49.67 30.68,51.87 22.08,51.87 v1(19.48,49.27) ; v1(48.39,42.15) 47.27,43.27 47.27,46.08 45.53,47.81 45.53,54.29 44.56,55.26 38.34,55.26 37.05,56.55 37.05,58.33 H6.18
IO21: length 64.9
  Top Layer w0.254: H2.4 20.65,40.84 20.65,43.9 21.32,44.57 21.32,50.56 20.94,50.94 v1(20.94,52.06) ; U52.33 v1(48.39,45.96) 47.38,44.96 v1(44.04,44.96)
  Bottom Layer w0.254: v1(44.04,44.96) 42.16,46.83 42.16,48.7 40.49,50.38 33.17,50.38 30.97,52.58 21.46,52.58 v1(20.94,52.06) ; H6.22 42.13,58.33 42.13,56.66 42.82,55.97 44.86,55.97 46.24,54.58 46.24,48.11 v1(48.39,45.96)
IO22: length 58
  Top Layer w0.254: 19.56,37.21 21.08,38.74 21.08,43.83 21.67,44.42 21.67,51.85 v1(22.99,53.16) ; v1(42.46,49.23) 47.85,49.23 v1(48.39,49.77) U52.36
  Bottom Layer w0.254: H6.28 49.57,58.51 49.57,56.66 48.88,55.97 48.12,55.97 47.4,55.25 47.4,51.21 48.39,50.22 v1(48.39,49.77) ; v1(22.99,53.16) 30.89,53.16 33.32,50.74 40.96,50.74 v1(42.46,49.23)
IO23: length 55
  Top Layer w0.254: R27.2 19.18,43.48 20.07,44.37 20.07,52.71 v1(20.03,52.74) ; U52.37 v1(48.39,51.04) 47.7,50.36 v1(42.46,50.36)
  Bottom Layer w0.254: v1(20.03,52.74) 21.04,53.75 30.81,53.75 33.47,51.09 41.72,51.09 v1(42.46,50.36) ; v1(48.39,51.04) 47.75,51.68 47.75,54.86 48.5,55.62 51.06,55.62 52.11,56.66 52.11,58.51 H6.30
IO25: length 51.4
  Top Layer w0.254: v1(15.88,17.91) 16.7,17.08 U19.16 ; 31.87,40.89 31.89,40.92 ; H6.17 34.67,56.13 34.67,42.29 33.26,40.88 U52.10 29.83,40.88 v1(29.82,40.88)
  Bottom Layer w0.254: v1(15.88,17.91) 15.88,19.3 16.48,19.91 16.48,22.2 24.67,30.39 24.67,35.73 v1(29.82,40.88)
IO26: length 55.1
  Top Layer w0.254: v1(30.68,36.07) 29.97,36.78 29.97,38.86 30.72,39.61 U52.11 33.26,39.61 35.03,41.38 35.03,55.72 35.28,55.97 37.81,55.97 38.23,56.39 H6.19 ; R49.1 39.87,14.74 39.11,15.5 v1(38.62,15.5) 38.2,15.08 37.5,15.08
  Bottom Layer w0.254: v1(38.62,15.5) 38.62,17.89 30.68,25.83 v1(30.68,36.07)
IO27: length 51.3
  Top Layer w0.254: v1(30.61,38.35) 32.13,38.35 U52.12 33.26,38.34 35.38,40.46 35.38,55.19 35.8,55.62 39.36,55.62 40.77,57.02 H6.21 ; v1(30.12,18.83) 30.75,18.2 30.75,17.64 31.62,16.76 31.62,15.88 31.91,15.58 U26.19
  Bottom Layer w0.254: v1(30.12,18.83) 29.74,19.21 29.74,37.49 v1(30.61,38.35)
IO32: length 61.4
  Top Layer w0.254: U52.8 31,43.42 30.99,43.43 ; 22.44,15.08 23.07,15.08 23.42,15.44 v1(23.42,15.5) 24,15.5 24.76,14.74 R44.1 ; H6.3 20.62,54.43 27.99,54.43 28.83,53.59 28.83,45.59 30.99,43.43 ; 30.99,43.43 v1(30.86,43.43)
  Bottom Layer w0.254: v1(23.42,15.5) 27.31,19.38 27.31,22.68 25.03,24.95 25.03,35.26 30.4,40.63 30.4,42.98 v1(30.86,43.43)
IO33: length 53.6
  Top Layer w0.254: H6.15 33.15,55.75 34.32,54.58 34.32,43.21 33.26,42.15 U52.9 29.87,42.15 v1(29.82,42.21) ; U19.19 16.26,15.58 v1(15.86,15.98)
  Bottom Layer w0.254: v1(15.86,15.98) 15.29,16.55 15.29,19.22 16.13,20.06 16.13,22.35 24.32,30.54 24.32,35.96 29.24,40.88 29.24,41.62 v1(29.82,42.21)
IO34: length 17.9
  Top Layer w0.254: U52.6 31,45.96 29.54,47.42 29.54,54.41 28.8,55.14 24.99,55.14 H6.7
IO35: length 21.5
  Top Layer w0.254: H6.5 20.45,56.9 22.56,54.79 28.4,54.79 29.18,54 29.18,46.38 30.87,44.69 U52.7
M0OA+: length 9.1
  Top Layer w0.406: 16.94,6.48 16.94,9.42 17.81,10.29 19.05,10.29 19.69,10.92 19.69,12.76 19.44,13.01 U19.24
M0OA-: length 10.3
  Top Layer w0.406: v2(16.64,14.57) 16.65,14.58 U19.21
  Bottom Layer w0.406: 18.94,6.48 18.94,7.73 16.13,10.54 16.13,14.06 v2(16.64,14.57)
M0OB+: length 7.5
  Top Layer w0.406: U19.26 20.44,13.01 20.19,12.76 20.19,8.25 20.94,7.5 20.94,6.48
M0OB-: length 9.8
  Top Layer w0.406: U19.1 23.39,14.58 v2(23.45,14.53)
  Bottom Layer w0.406: v2(23.45,14.53) 24,13.97 24,8.89 22.94,7.83 22.94,6.48
M1OA+: length 9.2
  Top Layer w0.406: U26.24 34.5,10.75 33.66,9.91 32.26,9.91 31.67,9.32 U55.1
M1OA-: length 11.1
  Top Layer w0.406: U26.21 v1(31.5,14.58)
  Bottom Layer w0.406: v1(31.5,14.58) 30.35,13.44 30.35,10.92 33.67,7.6 U55.2
M1OB+: length 7.7
  Top Layer w0.406: U55.3 35.69,6.37 35.69,7.68 35.05,8.31 35.05,12.32 35.5,12.77 U26.26
M1OB-: length 10.2
  Top Layer w0.406: U26.1 38.34,14.58 v1(38.6,14.33)
  Bottom Layer w0.406: v1(38.6,14.33) 39.37,13.55 39.37,9.4 37.67,7.7 U55.4
M2OA+: length 9.3
  Top Layer w0.406: 49.13,13.58 49.13,12.48 49.4,12.2 49.4,10.8 48.64,10.03 47.4,10.03 46.53,9.16 U56.1
M2OA-: length 10.9
  Top Layer w0.406: v2(46.1,14.61) 46.12,14.58 U28.21
  Bottom Layer w0.406: v2(46.1,14.61) 45.34,13.84 45.34,10.8 48.53,7.6 U56.2
M2OB+: length 7.6
  Top Layer w0.406: U28.26 50.13,12.54 49.91,12.32 49.91,8.12 50.53,7.5 U56.3
M2OB-: length 10.1
  Top Layer w0.406: U28.1 53.21,14.58 v2(53.27,14.53)
  Bottom Layer w0.406: v2(53.27,14.53) 53.85,13.95 53.85,8.89 52.53,7.57 U56.4
RTS: length 14.3
  Top Layer w0.254: 54.99,42.97 56.72,42.97 v1(57.32,43.57) ; v1(58.67,45.64) 58.67,46.61 Q1.2 58.74,46.7 TP2.1 ; 54.98,42.92 54.1,42.04 54.1,39.24 52.68,37.82 U1.13
  Bottom Layer w0.254: v1(57.32,43.57) 58.67,44.92 v1(58.67,45.64)
RXD0: length 45.9
  Top Layer w0.254: LED1.2 56.36,50.83 54.64,50.83 51.04,47.23 U52.34 v1(48.39,47.23) ; U1.4 54.88,33.95 55.05,33.78 55.43,33.78 55.48,33.83 v1(55.48,33.87)
  Bottom Layer w0.254: H6.24 44.67,58.33 44.67,56.66 46.6,54.73 46.6,49.02 v1(48.39,47.23) 50.94,47.23 54.64,43.53 54.64,39.57 56.13,38.09 56.13,37.6 55.75,37.23 55.75,34.14 v1(55.48,33.87)
TXD0: length 43.6
  Top Layer w0.254: 55.58,35.07 55.58,34.72 55.83,34.47 v1(56.34,34.47) ; U49.2 54.49,51.18 51.81,48.5 U52.35 49.63,48.51 v1(48.39,48.51)
  Bottom Layer w0.254: H6.26 45.85,59.44 47.21,58.08 47.21,55.72 46.95,55.46 46.95,49.95 v1(48.39,48.51) 50.79,48.51 51.44,47.87 51.44,47.24 55,43.67 55,39.72 56.77,37.95 56.77,34.9 v1(56.34,34.47)
VN: length 14.6
  Top Layer w0.254: H6.9 25.53,57.02 27.05,55.5 29.21,55.5 29.9,54.81 29.9,48.34 31,47.23 U52.5
VP: length 11.1
  Top Layer w0.254: U52.4 31.12,48.5 30.25,49.38 30.25,55.21 28.21,57.25 28.07,57.25
$1N2004: length 51.5
  Top Layer w0.254: v1(33.7,52.19) 32.56,51.04 U52.2 ; v1(51.82,31.19) 50.22,31.19 47.37,34.04 47.37,35.88 46.03,37.22 44.96,37.22 v1(44.84,37.34) ; v1(44.03,38.19) 40.3,41.91 37.97,41.91 36.83,43.05 36.83,50.04 37.59,50.8 37.59,51.63 v1(37.03,52.19) ; v1(58.03,30.45) 58.12,30.35 63.63,30.35 64.9,29.08 64.9,27.56
  Bottom Layer w0.254: v1(33.7,52.19) v1(37.03,52.19) ; v1(44.03,38.19) 44.03,38.15 v1(44.84,37.34) ; v1(51.82,31.19) 57.28,31.19 v1(58.03,30.45)
$2N678: length 4.2
  Top Layer w0.254: U19.4 23.51,16.08 C44.2
$2N1810: length 2
  Top Layer w0.254: U19.23 18.94,13.1 18.41,12.57 18.41,11.82
$2N25649: length 4.2
  Top Layer w0.254: U26.4 38.63,16.08 C50.2
$2N25650: length 1.8
  Top Layer w0.254: C52.2 36.19,20.13 36.19,19.56 36.5,19.25 U26.8
$2N25653: length 3
  Top Layer w0.254: U26.5 38.1,16.58 38.74,17.22 38.74,17.78 39.24,18.29 C50.1
$2N25654: length 4.1
  Top Layer w0.254: C51.2 38.35,19.12 38.35,17.54 37.9,17.08 U26.6
$2N25667: length 2.2
  Top Layer w0.254: 33.27,11.64 33.27,12.45 34,13.17 U26.23
$2N25668: length 2.2
  Top Layer w0.254: U26.27 36,13.15 36.7,12.45 36.7,11.64
$2N26519: length 4.1
  Top Layer w0.254: U28.4 52.82,16.08 55.16,18.42 C57.2
$2N26520: length 1.8
  Top Layer w0.254: C59.2 50.74,19.62 51.13,19.23 U28.8
$2N26523: length 2.9
  Top Layer w0.254: U28.5 52.65,16.58 53.21,17.14 53.21,17.67 53.91,18.37 C57.1
$2N26524: length 4.1
  Top Layer w0.254: C58.2 52.86,19.14 52.86,17.41 52.53,17.08 U28.6
$2N26537: length 2.2
  Top Layer w0.254: 48.01,11.64 48.01,12.56 48.63,13.18 U28.23
$2N40810: length 2.8
  Top Layer w0.254: 23.81,17.78 C44.1 ; U19.5 23.06,16.58 23.81,17.34 23.81,17.78
$2N40851: length 4.3
  Top Layer w0.254: C45.2 24.26,20.19 23.37,19.3 23.37,17.4 23.05,17.08 U19.6
$2N40853: length 1.7
  Top Layer w0.254: C46.2 21.14,19.62 21.44,19.33 U19.8
$2N42197: length 2
  Top Layer w0.254: 21.46,11.77 21.46,12.57 20.96,13.08 20.96,13.57 U19.27
$2N47460: length 2.3
  Top Layer w0.254: 51.44,11.64 51.44,12.37 50.63,13.18 U28.27
$3N814: length 17.8
  Top Layer w0.254: 33.47,27.2 33.44,27.18 30.73,27.18 29.59,26.04 28.07,26.04 27.56,26.54 27.56,28.32 27.12,28.76 U33.1
  Top Layer w0.762: L3.2 33.47,28.14 C9.2 C10.2
  Top Layer w1.27: F2.1 35.81,27.93 L3.2
$3N816: length 5.3
  Top Layer w0.762: C8.2 29.46,30.61 30.75,29.32 L3.1 30.75,28.97 29.59,27.81 U33.5
$3N819: length 5.9
  Top Layer w0.254: U33.2 26.35,27.8 ; 26.35,26.87 26.36,26.86
  Top Layer w0.762: U33.2 25.65,27.81 25.4,27.56 23.75,27.56 ; 26.36,26.86 26.36,26.29 26.73,25.92 C64.2 ; 26.35,27.8 26.35,26.87
$3N821: length 12.8
  Top Layer w0.762: BT1.1 60.25,29.59 U40.2 58.1,27.78 58.17,27.72
  Top Layer w1.27: 58.17,27.72 56.73,27.72 U18.4 U18.2
$3N1344: length 1.9
  Top Layer w0.254: POWER.2 1.56,19.65 1.82,19.39 R5.1
$3N1346: length 1.8
  Top Layer w0.254: R4.1 58.63,32.56 58.89,32.3 USB.2
$3N12295: length 2.6
  Top Layer w0.762: C8.1 27.37,29.78 28.39,28.76 U33.6
$3N15356: length 8.1
  Top Layer w1.524: U42.2 11.94,28.32 12.83,29.21 14.33,29.21 U38.2
  Top Layer w1.778: U38.2 14.35,24.39 14.35,24.38
$3N15365: length 11.7
  Bottom Layer w1.778: DC1.1 14.43,15.66 11.43,18.66 U42.1
$3N30933: length 14
  Top Layer w0.457: C36.1 58.51,22.73 56.6,24.64 50,24.64 U18.3
  Top Layer w1.27: U18.3 48.66,24.62 48.22,25.06 U48.2
$3N43041: length 1.9
  Top Layer w0.254: R6.1 62.57,27.99 MCU2.2
$3N43183: length 1.8
  Top Layer w0.254: R51.1 45.88,30.11 5V.2
$4N1482: length 5.1
  Top Layer w0.254: Q1.1 58.54,44.59 57.94,44.59 57.57,44.97 57.57,46.14 57.28,46.42 R36.1
$4N1521: length 3.7
  Top Layer w0.254: Q2.1 56.69,41.27 56.5,41.47 R37.1
$4N2394: length 1.7
  Top Layer w0.254: 59.36,57.95 59.36,57.15 59.38,57.15 59.56,56.97 59.56,56.46 R39.2
$4N2398: length 2.9
  Top Layer w0.254: R38.1 57.78,57.02 57.53,57.28 56.63,57.28 55.96,57.95
$4N2404: length 2.2
  Top Layer w0.254: SW1.4 64.39,44.91 63.98,45.32 R33.2
$4N3230: length 1.7
  Top Layer w0.254: R10.1 U49.1
$4N3238: length 1.7
  Top Layer w0.254: 59.91,49.23 61.57,49.23
$4N5658: length 2
  Top Layer w0.254: 55.58,35.57 56.51,35.57 56.9,35.18 C2.2

## Copper pours and planes (outline as drawn; the poured copper is in the pictures)
GND on Top Layer: -10.67,63.5 83.44,63.5 83.44,-3.81 -10.67,-3.81
GND on Bottom Layer: -5.46,69.22 70.61,69.22 70.61,-16.51 -5.46,-16.51

Small or netless copper shapes (teardrops, artwork), in the pictures only: 362 on Top Layer, 105 on Bottom Layer

## Text on the board
Bottom Silkscreen Layer: A- | B+ | B- | MOTOR 0 | MOTOR 1 | MOTOR 2 | A+ | SERVO | GND | +5V | PWM | 3V3 | IO15 | M2DIR | IO32 | M0EN | IO2 | M2STEP | IO35 | IO0 | IO34 | IO4 | VN | IO16 | RXD2 | VP | IO17 | TXD2 | EN | IO5 | CS | IO33 | M0DIR | IO18 | CLK | IO25 | M0STEP | IO19 | MISO | IO26 | M1EN | IO21 | SDA | IO27 | M1DIR | RXD0 | IO14 | M1STEP | TXD0 | IO12 | M2EN | IO22 | SCL | IO13 | CD | IO23 | MOSI | 5V | WriteBot Driver / Ver4 Rev1
Top Silkscreen Layer: MOTOR 0 | MOTOR 1 | MOTOR 2 | VIN | MICRO SD | DC INPUT | 5V | SERVO | SDA | SCL | 3V3 | GND | VIN→5V | 5V→3V3 | 3V3→MCU | TX0 | RX0 | EN | BOOT
